# Altium schematic sheet Sheet1.SchDoc
size A
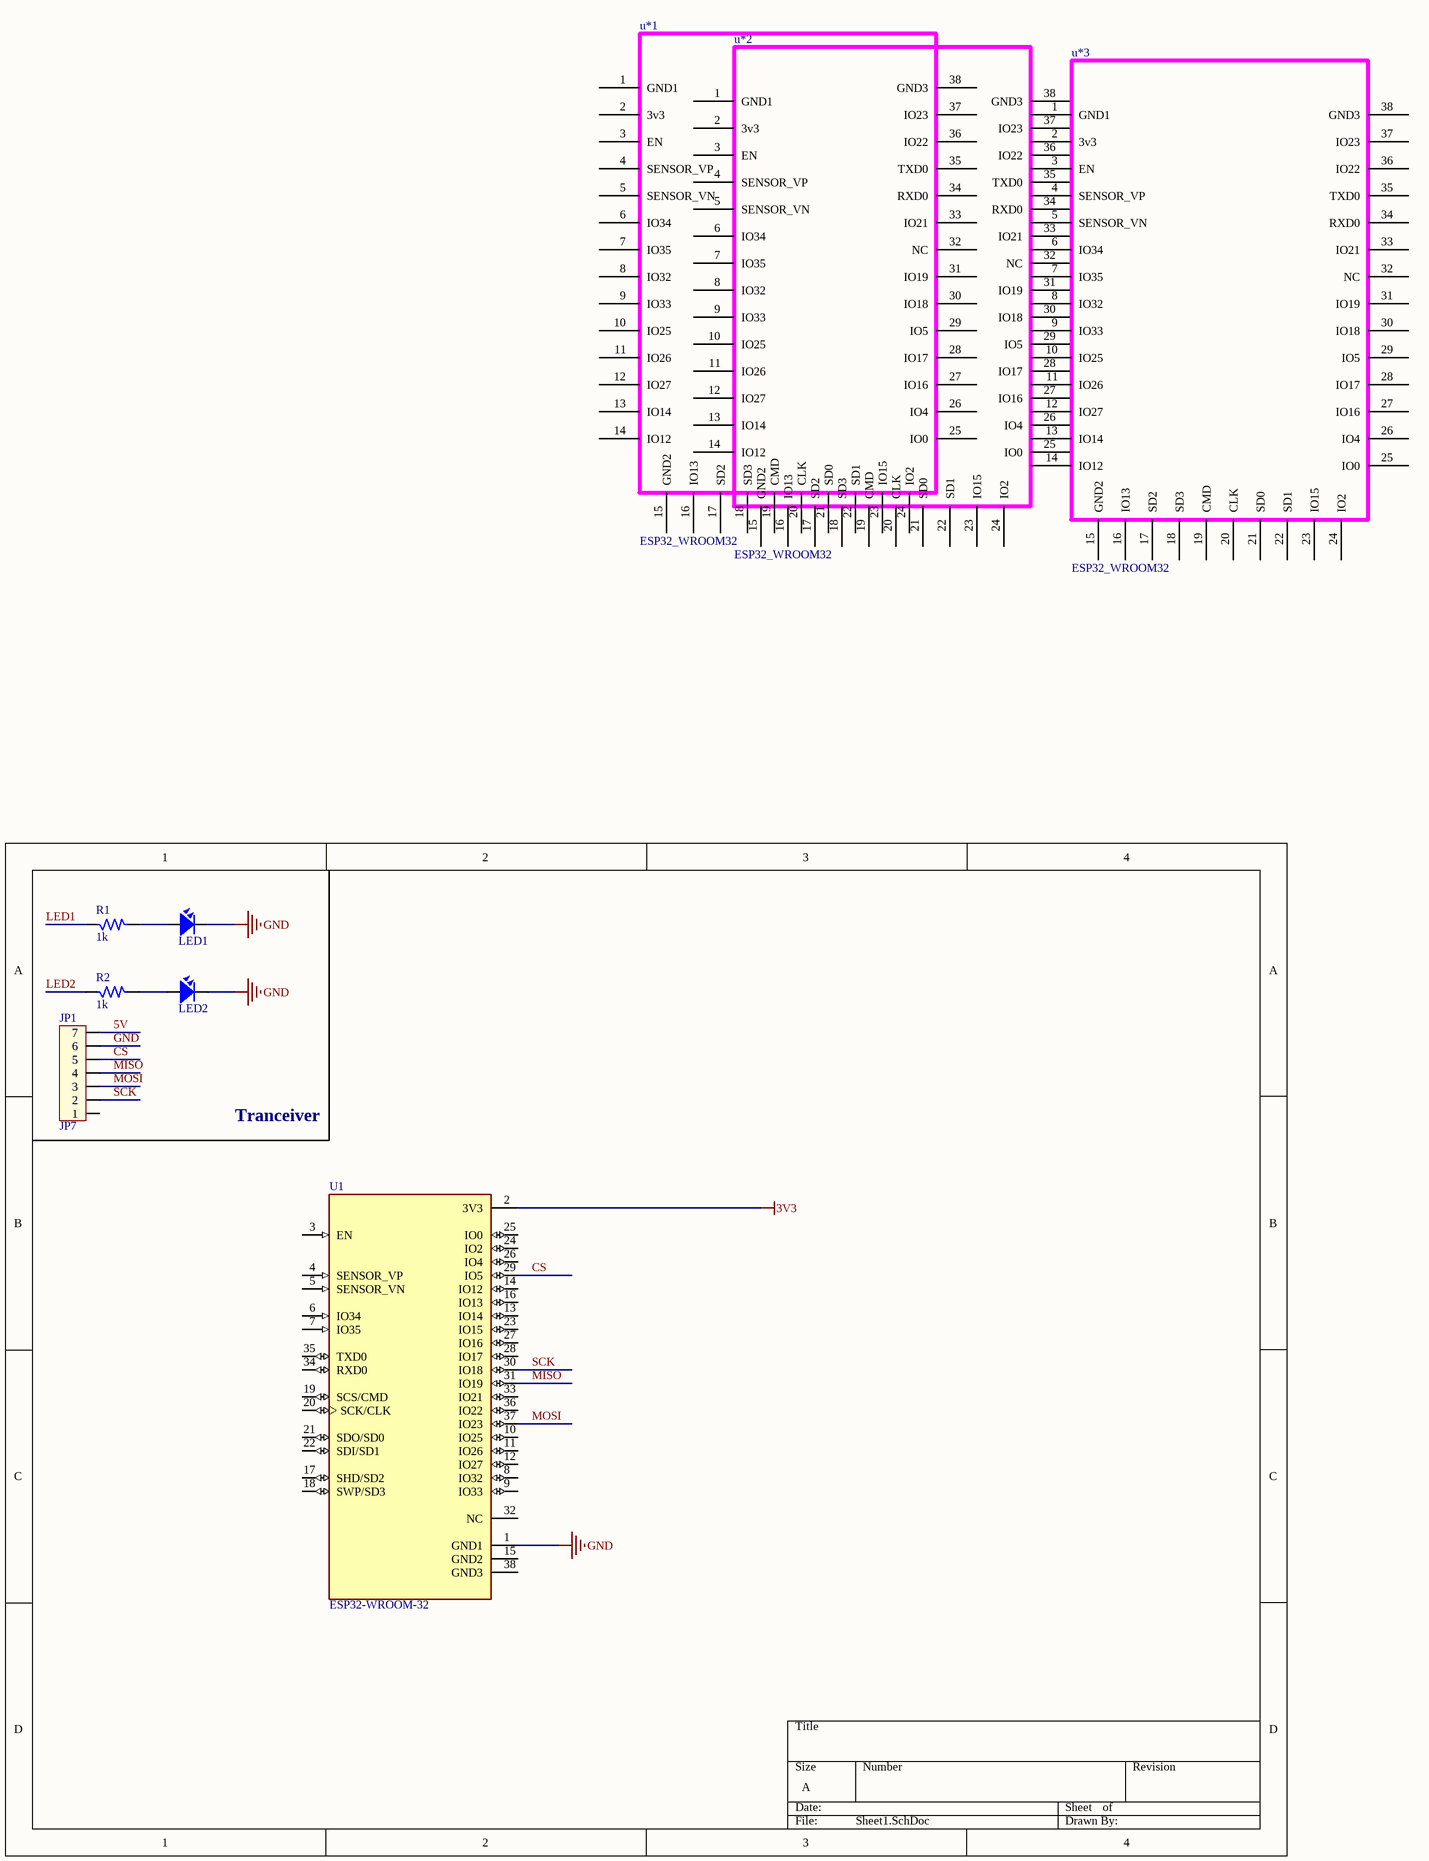
[diagram p0: Sheet1.SchDoc]

## Parts
JP1  JP7  [CON7]
LED1  LED SMD  [SM-LED-1206-Red]  (value not drawn)
LED2  LED SMD  [SM-LED-1206-Red]  (value not drawn)
R1  1k  [SM-RES-1206]
R2  1k  [SM-RES-1206]
U1  ESP32-WROOM-32  [MODULE_ESP32-WROOM-32]
u*1  ESP32_WROOM32
u*2  ESP32_WROOM32
u*3  ESP32_WROOM32

## Nets
3V3: U1.2(3V3)
GND: JP1.6 LED1.2 LED2.2 U1.1(GND1)
5V: JP1.7
CS: JP1.5 U1.29(IO5)
LED1: R1.1
LED2: R2.1
MISO: JP1.4 U1.31(IO19)
MOSI: JP1.3 U1.37(IO23)
SCK: JP1.2 U1.30(IO18)
NetLED1_1: LED1.1 R1.2
NetLED2_1: LED2.1 R2.2

Not connected (* = marked no-connect by the designer): JP1 1; U1 3(EN) 4(SENSOR_VP) 5(SENSOR_VN) 6(IO34) 7(IO35) 8(IO32) 9(IO33) 10(IO25) 11(IO26) 12(IO27) 13(IO14) 14(IO12) 15(GND2) 16(IO13) 17(SHD/SD2) 18(SWP/SD3) 19(SCS/CMD) 20(SCK/CLK) 21(SDO/SD0) 22(SDI/SD1) 23(IO15) 24(IO2) 25(IO0) 26(IO4) 27(IO16) 28(IO17) 32(NC) 33(IO21) 34(RXD0) 35(TXD0) 36(IO22) 38(GND3); u*1 1(GND1) 2(3v3) 3(EN) 4(SENSOR_VP) 5(SENSOR_VN) 6(IO34) 7(IO35) 8(IO32) 9(IO33) 10(IO25) 11(IO26) 12(IO27) 13(IO14) 14(IO12) 15(GND2) 16(IO13) 17(SD2) 18(SD3) 19(CMD) 20(CLK) 21(SD0) 22(SD1) 23(IO15) 24(IO2) 25(IO0) 26(IO4) 27(IO16) 28(IO17) 29(IO5) 30(IO18) 31(IO19) 32(NC) 33(IO21) 34(RXD0) 35(TXD0) 36(IO22) 37(IO23) 38(GND3); u*2 1(GND1) 2(3v3) 3(EN) 4(SENSOR_VP) 5(SENSOR_VN) 6(IO34) 7(IO35) 8(IO32) 9(IO33) 10(IO25) 11(IO26) 12(IO27) 13(IO14) 14(IO12) 15(GND2) 16(IO13) 17(SD2) 18(SD3) 19(CMD) 20(CLK) 21(SD0) 22(SD1) 23(IO15) 24(IO2) 25(IO0) 26(IO4) 27(IO16) 28(IO17) 29(IO5) 30(IO18) 31(IO19) 32(NC) 33(IO21) 34(RXD0) 35(TXD0) 36(IO22) 37(IO23) 38(GND3); u*3 1(GND1) 2(3v3) 3(EN) 4(SENSOR_VP) 5(SENSOR_VN) 6(IO34) 7(IO35) 8(IO32) 9(IO33) 10(IO25) 11(IO26) 12(IO27) 13(IO14) 14(IO12) 15(GND2) 16(IO13) 17(SD2) 18(SD3) 19(CMD) 20(CLK) 21(SD0) 22(SD1) 23(IO15) 24(IO2) 25(IO0) 26(IO4) 27(IO16) 28(IO17) 29(IO5) 30(IO18) 31(IO19) 32(NC) 33(IO21) 34(RXD0) 35(TXD0) 36(IO22) 37(IO23) 38(GND3)

## Notes on the sheet
- Tranceiver

## Library data of the parts
JP1 = Con7: Connector 7; Value: Connector 7
LED1 LED2 = LED-SMD-1206
R1 R2 = R: Resistor 1/4W; Value: R1/4W - 1K
U1 = ESP32-WROOM-32: Bluetooth, WiFi 802.11b/g/n, Bluetooth v4.2 +EDR, Class 1, 2 and 3 Transceiver Module 2.4GHz ~ 2.5GHz Antenna Not Included, U.FL Surface Mount; MF: Espressif Systems; Price: None; Availability: In Stock; MP: ESP32-WROOM-32; Package: Module Espressif Systems; SnapEDA_Link: https://www.snapeda.com/parts/ESP32-WROOM-32/Espressif+Systems/view-part/?ref=snap; Check_prices: https://www.snapeda.com/parts/ESP32-WROOM-32/Espressif+Systems/view-part/?ref=eda; Value: *; Purchase-URL: https://pricing.snapeda.com/search/part/ESP32-WROOM-32/?ref=eda